# EAGLE design schemat (EAGLE 9.5.2)
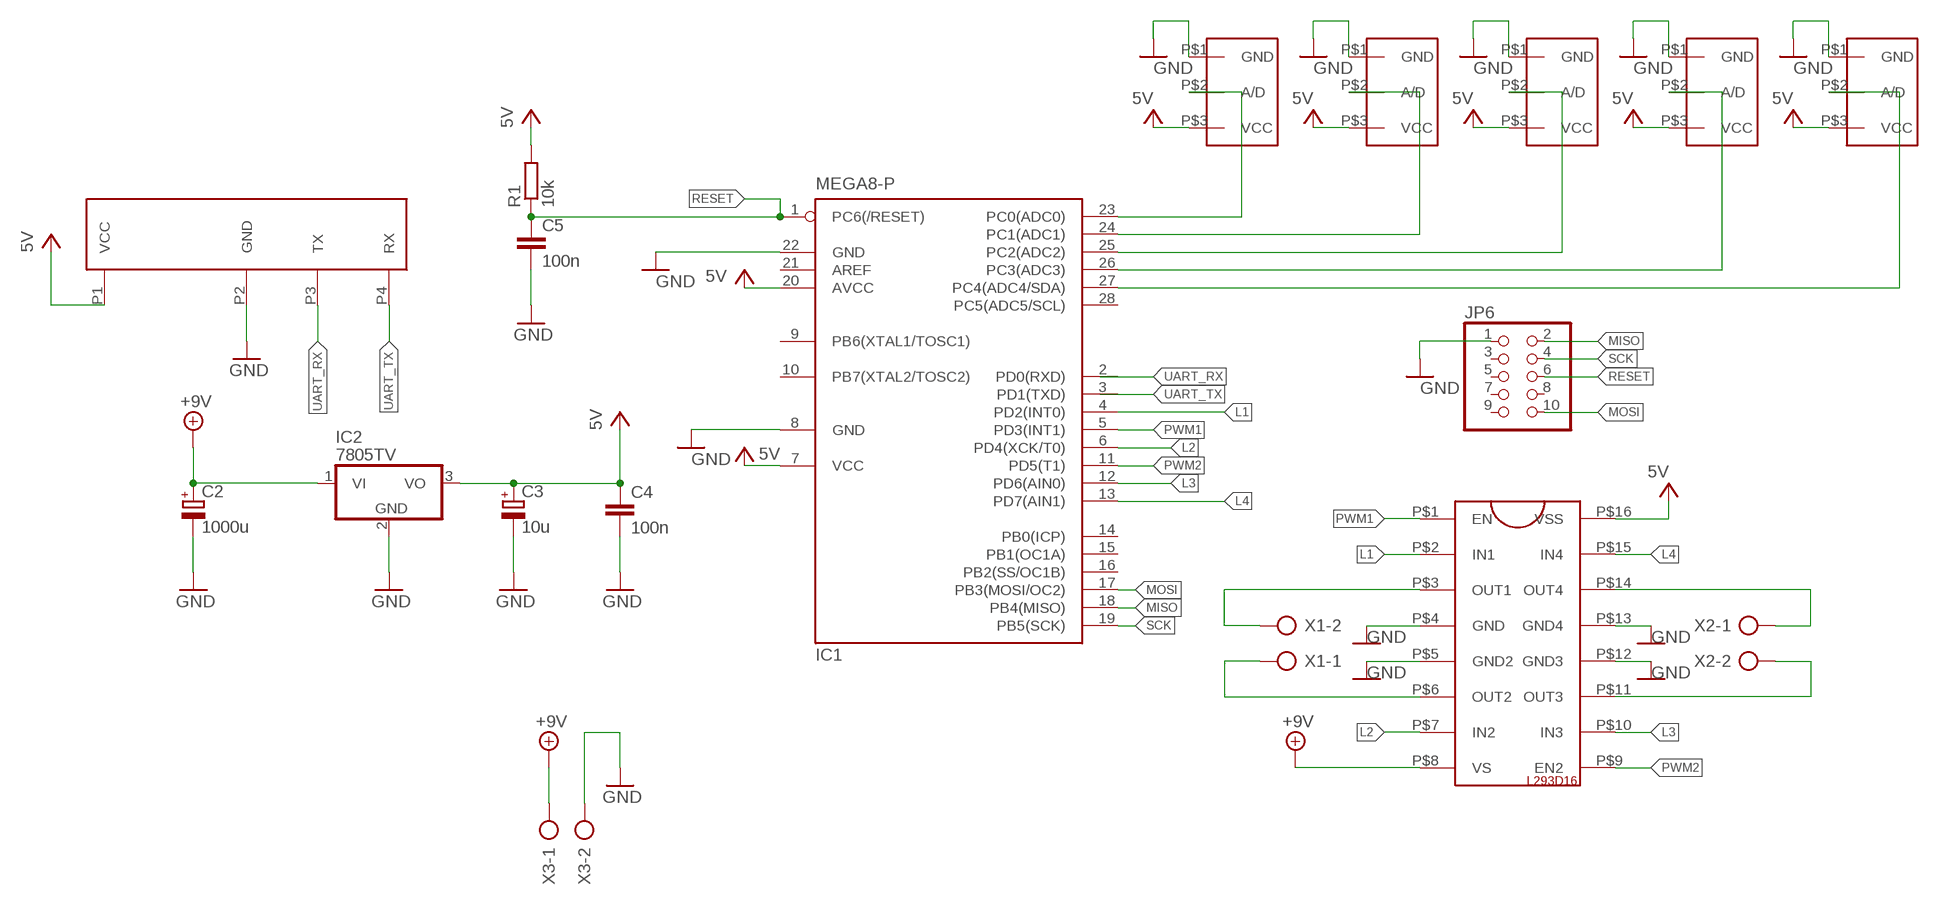
[diagram p0: schematic, sheet 1]

## Parts
C2  1000u  CPOL-EUE5-10.5  [E5-10,5]
C3  10u  CPOL-EUE5-10.5  [E5-10,5]
C4  100n  C-EU050-075X075  [C050-075X075]
C5  100n  C-EU050-075X075  [C050-075X075]
IC1  MEGA8-P  [DIL28-3]
IC2  7805TV  [TO220V]
JP6  PINHD-2X5  [2X05]
R1  10k  R-EU_0309/10  [0309/10]
TCRT1  TCRT5000  [TCRT5000]
TCRT2  TCRT5000  [TCRT5000]
TCRT6  TCRT5000  [TCRT5000]
TCRT7  TCRT5000  [TCRT5000]
TCRT8  TCRT5000  [TCRT5000]
U$1  BTM222BTM222  [BTM222]
U$2  L293D16L293D16  [L293D]
X1  AK500/2  [AK500/2]
X2  AK500/2  [AK500/2]
X3  AK500/2  [AK500/2]

## Nets
+9V: C2.+ IC2.1(VI) U$2.P$8(VS) X3.1
GND: C2.- C3.- C4.2 C5.2 IC1.8(GND) IC1.22(GND) IC2.2(GND) JP6.1 TCRT1.P$1(GND) TCRT2.P$1(GND) TCRT6.P$1(GND) TCRT7.P$1(GND) TCRT8.P$1(GND) U$1.P2(GND) U$2.P$4(GND) U$2.P$5(GND2) U$2.P$12(GND3) U$2.P$13(GND4) X3.2
L1: IC1.4(PD2(INT0)) U$2.P$2(IN1)
L2: IC1.6(PD4(XCK/T0)) U$2.P$7(IN2)
L3: IC1.12(PD6(AIN0)) U$2.P$10(IN3)
L4: IC1.13(PD7(AIN1)) U$2.P$15(IN4)
MISO: IC1.18(PB4(MISO)) JP6.2
MOSI: IC1.17(PB3(MOSI/OC2)) JP6.10
N$1: IC1.24(PC1(ADC1)) TCRT1.P$2(A/D)
N$2: IC1.25(PC2(ADC2)) TCRT8.P$2(A/D)
N$3: IC1.23(PC0(ADC0)) TCRT2.P$2(A/D)
N$4: IC1.26(PC3(ADC3)) TCRT7.P$2(A/D)
N$5: IC1.27(PC4(ADC4/SDA)) TCRT6.P$2(A/D)
N$6: U$2.P$6(OUT2) X1.1
N$7: U$2.P$3(OUT1) X1.2
N$8: U$2.P$14(OUT4) X2.1
N$9: U$2.P$11(OUT3) X2.2
PWM1: IC1.5(PD3(INT1)) U$2.P$1(EN)
PWM2: IC1.11(PD5(T1)) U$2.P$9(EN2)
RESET: C5.1 IC1.1(PC6(/RESET)) JP6.6 R1.1
SCK: IC1.19(PB5(SCK)) JP6.4
UART_RX: IC1.2(PD0(RXD)) U$1.P3(TX)
UART_TX: IC1.3(PD1(TXD)) U$1.P4(RX)
VCC: C3.+ C4.1 IC1.7(VCC) IC1.20(AVCC) IC2.3(VO) R1.2 TCRT1.P$3(VCC) TCRT2.P$3(VCC) TCRT6.P$3(VCC) TCRT7.P$3(VCC) TCRT8.P$3(VCC) U$1.P1(VCC) U$2.P$16(VSS) ; supply symbol labelled 5V
Unconnected: IC1.9(PB6(XTAL1/TOSC1)) IC1.10(PB7(XTAL2/TOSC2)) IC1.14(PB0(ICP)) IC1.15(PB1(OC1A)) IC1.16(PB2(SS/OC1B)) IC1.21(AREF) IC1.28(PC5(ADC5/SCL)) JP6.3 JP6.5 JP6.7 JP6.8 JP6.9

## Library data of the parts
C2 C3 = rcl:CPOL-EU: POLARIZED CAPACITOR, European symbol; SPICEPREFIX: C
C4 C5 = rcl:C-EU: CAPACITOR, European symbol; SPICEPREFIX: C
IC1 = atmel:MEGA8-P: MICROCONTROLLER 8 Kbytes FLASH, 1 kbytes SRAM, 512 bytes EEPROM, USART, 4-channel 10 bit ADC, 2-channel 8 bit ADC Pin compatible with Atmega48, ATMega88, ATMega168 Source: avr.lbr; OC_FARNELL: unknown; OC_NEWARK: unknown
IC2 = linear:78*: Positive VOLTAGE REGULATOR Source: http://cache.national.com/ds/LM/LM78L05.pdf http://www.fairchildsemi.com/ds/LM/LM7805.pdf
JP6 = pinhead:PINHD-2X5: PIN HEADER
R1 = rcl:R-EU_: RESISTOR, European symbol; SPICEPREFIX: R
TCRT1 TCRT2 TCRT6-TCRT8 = LIB1:TCRT5000
U$1 = LIB1:BTM222
U$2 = my_library:L293D16
X1-X3 = con-ptr500:AK500/2: CONNECTOR; OC_FARNELL: unknown; OC_NEWARK: unknown

## Board
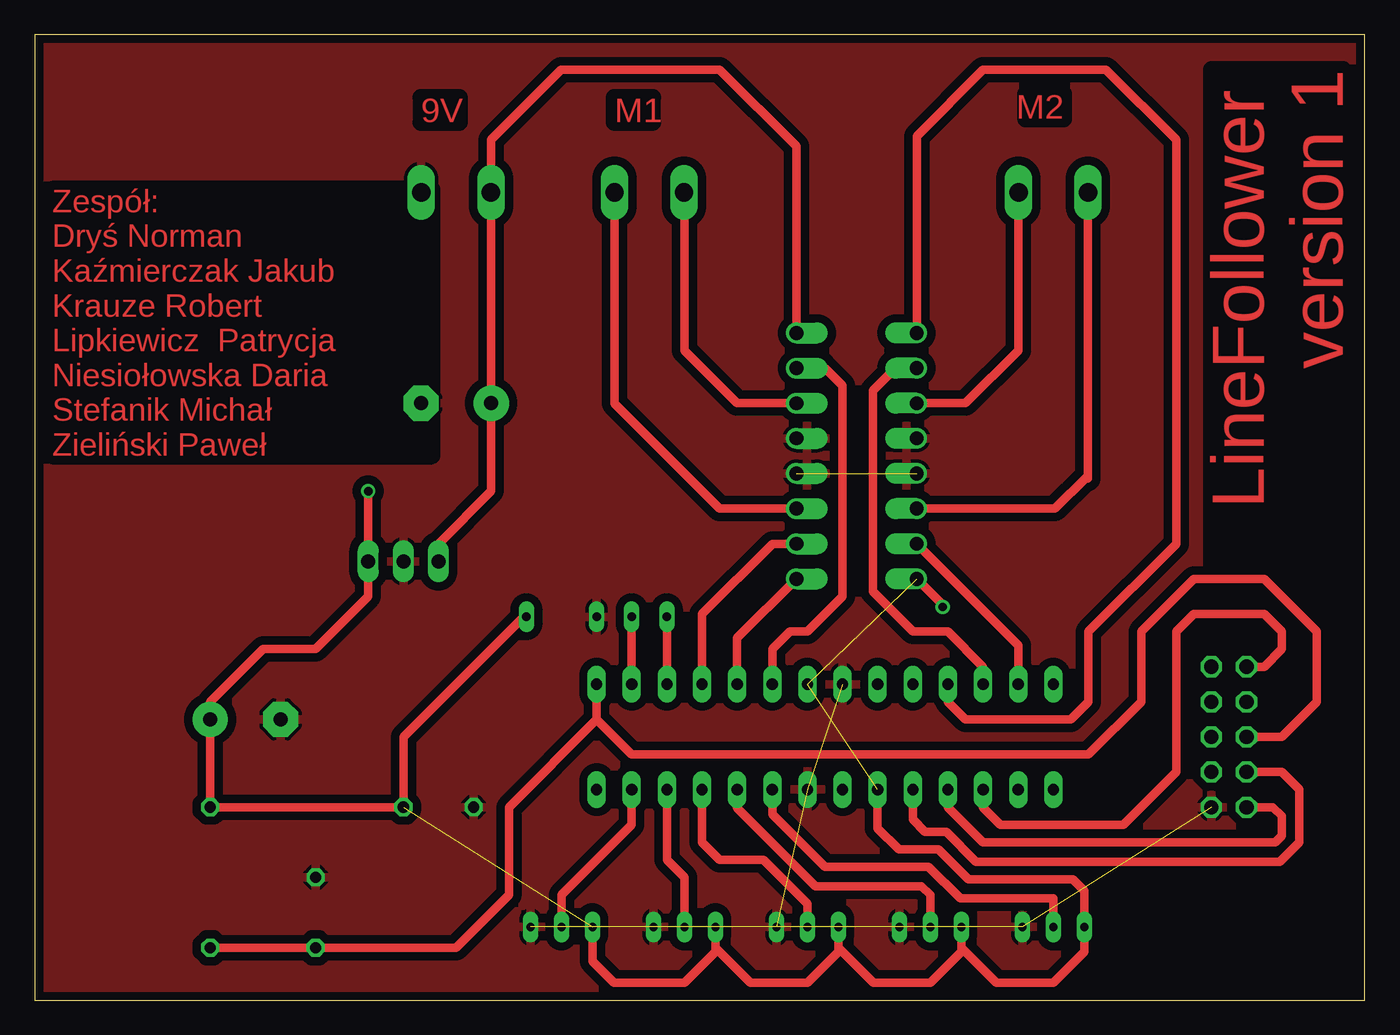
[diagram p1: board, top side]
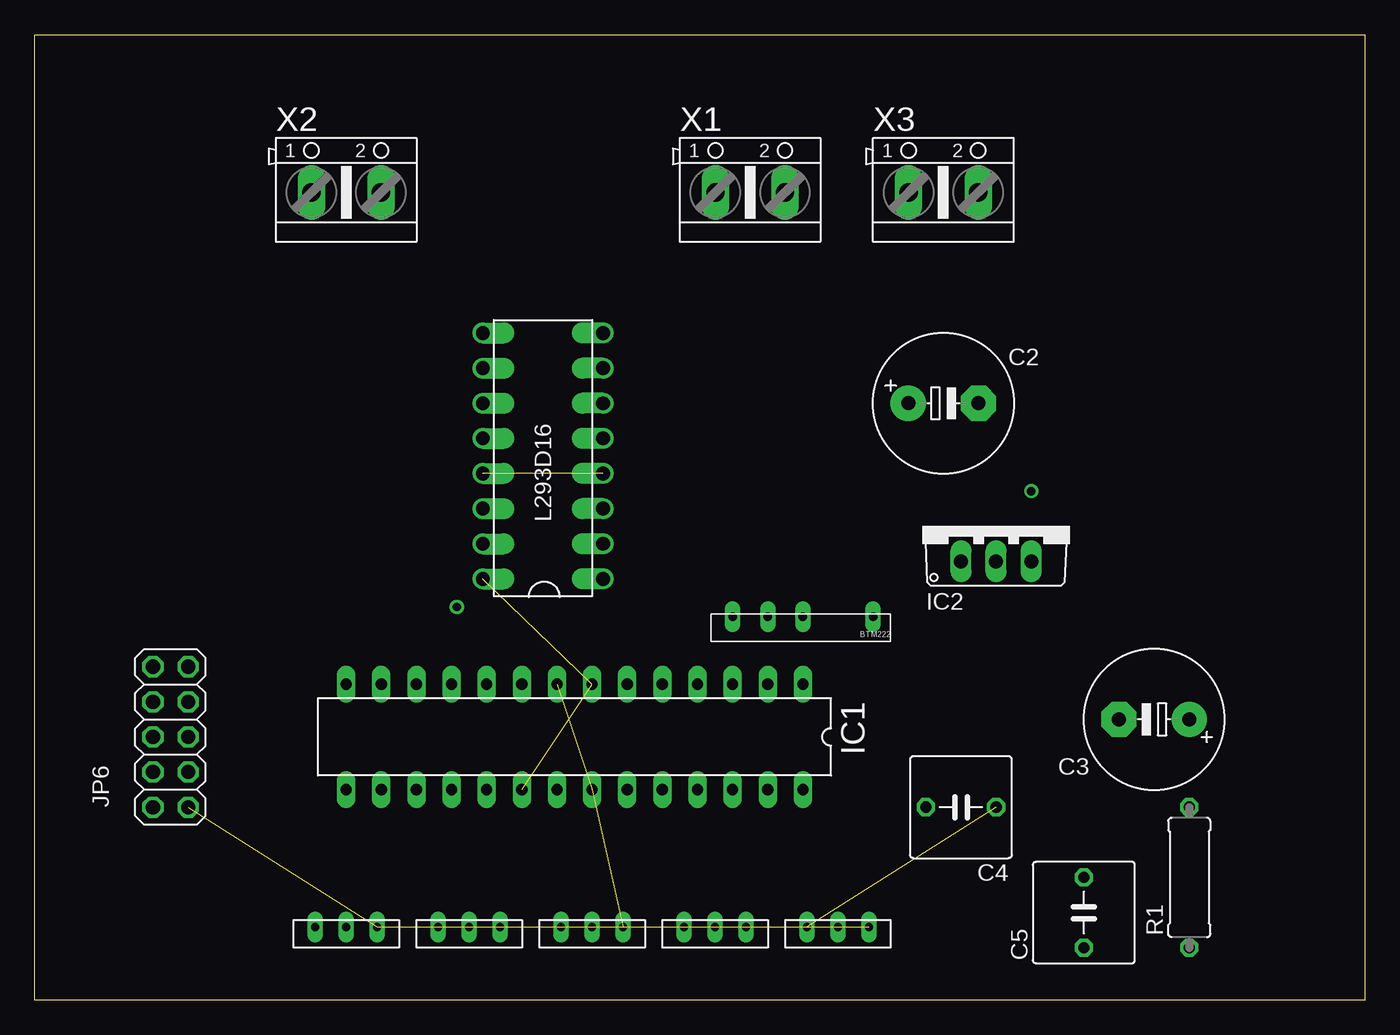
[diagram p2: board, bottom side, seen from below]

Size 96.19 x 69.84 mm. Coordinates in mm from the lower left corner, seen from the top.
Outline: 0,0 96.19,0 96.19,69.84 0,69.84 0,0
Copper layers (1*16): Top 0.035mm / dielectric 1.5mm / Bottom 0.035mm
Design rules "default *": minimum track width 24mil, minimum drill 24mil, track to track 24mil, track to pad 24mil, pad to pad 24mil, via to via 24mil, smd to smd 24mil, copper to edge 24mil, drill to drill 24mil, minimum pad ring 10mil, minimum via ring 8mil, stop-mask expansion 4mil, vias tented up to drill 0mil, thermal gap 10mil

### Footprints (pad centres in the part's own frame; a part is rotated, then mirrored left to right if it is on the bottom)
E5-10,5 = drill 1.016 pad 2.54: + -2.54,0 | drill 1.016 pad 2.54 octagon: - 2.54,0
C050-075X075 = drill 0.813 octagon: 1 -2.54,0; 2 2.54,0
DIL28-3 = drill 0.813 long: 1 -16.51,-3.81; 2 -13.97,-3.81; 3 -11.43,-3.81; 4 -8.89,-3.81; 5 -6.35,-3.81; 6 -3.81,-3.81; 7 -1.27,-3.81; 8 1.27,-3.81; 9 3.81,-3.81; 10 6.35,-3.81; 11 8.89,-3.81; 12 11.43,-3.81; 13 13.97,-3.81; 14 16.51,-3.81; 15 16.51,3.81; 16 13.97,3.81; 17 11.43,3.81; 18 8.89,3.81; 19 6.35,3.81; 20 3.81,3.81; 21 1.27,3.81; 22 -1.27,3.81; 23 -3.81,3.81; 24 -6.35,3.81; 25 -8.89,3.81; 26 -11.43,3.81; 27 -13.97,3.81; 28 -16.51,3.81
TO220V = drill 1.016 long: 1 -2.54,-2.54; 2 0,-2.54; 3 2.54,-2.54
2X05 = drill 1.016 octagon: 1 -5.08,-1.27; 2 -5.08,1.27; 3 -2.54,-1.27; 4 -2.54,1.27; 5 0,-1.27; 6 0,1.27; 7 2.54,-1.27; 8 2.54,1.27; 9 5.08,-1.27; 10 5.08,1.27
0309/10 = drill 0.813 octagon: 1 -5.08,0; 2 5.08,0
TCRT5000 = drill 0.6 long: P$1 1.5,1.57; P$2 1.5,3.81; P$3 1.5,6.05
BTM222 = drill 0.6 long: P1 1.27,0.2; P2 6.35,0.2; P3 8.89,0.2; P4 11.43,0.2
L293D = drill 1 offset: P$1 1.27,-0.8; P$2 3.81,-0.8; P$3 6.35,-0.8; P$4 8.89,-0.8; P$5 11.43,-0.8; P$6 13.97,-0.8; P$7 16.51,-0.8; P$8 19.05,-0.8; P$9 19.05,7.9; P$10 16.51,7.9; P$11 13.97,7.9; P$12 11.43,7.9; P$13 8.89,7.9; P$14 6.35,7.9; P$15 3.81,7.9; P$16 1.27,7.9
AK500/2 = drill 1.321 long: 1 -2.515,0; 2 2.515,0

### Placement (x,y rotation side)
C2  30.48,43.18 0 bottom
C3  15.24,20.32 180 bottom
C4  29.21,13.97 180 bottom
C5  20.32,6.35 90 bottom
IC1  57.15,19.05 180 bottom
IC2  26.67,34.29 0 bottom
JP6  86.36,19.05 90 bottom
R1  12.7,8.89 90 bottom
TCRT1  60.96,3.81 90 bottom
TCRT2  69.85,3.81 90 bottom
TCRT6  34.29,3.81 90 bottom
TCRT7  43.18,3.81 90 bottom
TCRT8  52.07,3.81 90 bottom
U$1  34.29,27.94 180 bottom
U$2  55.88,29.21 90 bottom
X1  44.45,58.42 0 bottom
X2  73.66,58.42 0 bottom
X3  30.48,58.42 0 bottom

### Tracks (layer width: path | path; a pad name or v marks a point on that pad's centre or on a via)
+9V
  Top 0.61: U$2.P$8 55.08,61.76 49.53,67.31 38.08,67.31 33,62.23 X3.1 33.02,58.4 C2.+ 33.02,36.83 29.21,33.02 IC2.1
GND  (8 unrouted)
  pour Top: 0,69.85 0,0 96.52,0 96.52,69.85
L1
  Top 0.61: U$2.P$2 53.34,33.02 48.26,27.94 IC1.4
L2
  Top 0.61: U$2.P$7 57.15,45.72 58.42,44.45 58.42,29.21 55.88,26.67 54.61,26.67 53.34,25.4 IC1.6
L3
  Top 0.61: U$2.P$10 62.23,45.72 60.6,44.09 60.6,29.57 63.5,26.67 66.04,26.67 68.58,24.13 IC1.12
L4
  Top 0.61: U$2.P$15 71.12,25.68 IC1.13
MISO
  Top 0.61: IC1.18 66.04,13.97 68.58,11.43 89.72,11.43 90.17,11.88 90.17,13.34 89.53,13.97 JP6.2
MOSI
  Top 0.61: IC1.17 68.58,13.97 69.85,12.7 78.74,12.7 82.55,16.51 82.55,26.67 83.82,27.94 88.9,27.94 90.17,26.67 90.17,25.4 88.9,24.13 JP6.10
N$1
  Top 0.61: TCRT1.P$2 64.77,7.62 64.14,8.26 56.46,8.26 50.8,13.92 IC1.24
N$2
  Top 0.61: TCRT8.P$2 55.88,6.99 52.7,10.16 49.53,10.16 48.26,11.43 IC1.25
N$3
  Top 0.61: TCRT2.P$2 73.66,7.37 66.93,7.37 64.64,9.65 57.15,9.65 53.34,13.46 IC1.23
N$4
  Top 0.61: TCRT7.P$2 46.99,8.89 45.72,10.16 IC1.26
N$5
  Top 0.61: TCRT6.P$2 38.1,7.62 43.18,12.7 IC1.27
N$6
  Top 0.61: U$2.P$6 50.8,43.18 46.99,46.99 46.99,58.4 X1.1
N$7
  Top 0.61: U$2.P$3 49.53,35.56 41.94,43.16 X1.2
N$8
  Top 0.61: U$2.P$14 73.79,35.56 76.07,37.85 76.17,37.74 X2.1
N$9
  Top 0.61: X2.2 71.12,58.4 71.12,46.99 67.31,43.18 U$2.P$11
PWM1
  Top 0.61: U$2.P$1 50.8,26.2 IC1.5
PWM2
  Top 0.61: U$2.P$9 63.78,62.51 68.58,67.31 77.47,67.31 82.55,62.23 82.55,33.02 76.2,26.67 76.2,21.59 74.93,20.32 67.31,20.32 66.04,21.59 IC1.11
RESET
  Top 0.61: R1.1 C5.1 30.48,3.81 34.29,7.62 34.29,13.97 40.64,20.32 | IC1.1 40.64,20.32 | JP6.6 90.17,19.05 92.71,21.59 92.71,26.67 88.9,30.48 83.82,30.48 80.01,26.67 80.01,21.59 76.2,17.78 43.18,17.78 40.64,20.32
SCK
  Top 0.61: IC1.19 63.5,13.08 64.39,12.19 65.91,12.19 68.07,10.03 90.04,10.03 91.44,11.43 91.44,15.24 90.17,16.51 JP6.4
UART_RX
  Top 0.61: IC1.2 U$1.P3
UART_TX
  Top 0.61: IC1.3 U$1.P4
VCC  (via drill 0.61)  (3 unrouted)
  Top 0.61: TCRT6.P$3 40.34,2.84 41.91,1.27 46.99,1.27 49.23,3.51 49.23,3.81 | 49.23,3.81 TCRT7.P$3 | 49.23,3.81 51.77,1.27 55.88,1.27 58.12,3.51 58.12,3.81 | 58.12,3.81 TCRT8.P$3 | 58.12,3.81 60.66,1.27 64.77,1.27 67.01,3.51 67.01,3.81 | 67.01,3.81 TCRT1.P$3 | 67.01,3.81 69.55,1.27 73.66,1.27 75.9,3.51 TCRT2.P$3 75.9,7.92 75.06,8.76 67.51,8.76 65.35,10.92 62.48,10.92 60.96,12.45 IC1.20 60.96,13.97 | U$1.P1 35.36,27.74 26.67,19.05 C4.1 R1.2 C3.+ 12.7,21.59 16.51,25.4 20.32,25.4 24.13,29.21 IC2.3 v24.13,36.83 | U$2.P$16 65.66,28.6 v65.66,28.45

### Text on the board
Top: LineFollower / version 1 | M2 | 9V | M1 | Zespół: / Dryś Norman / Kaźmierczak Jakub / Krauze Robert / Lipkiewicz Patrycja / Niesiołowska Daria / Stefanik Michał / Zieliński Paweł